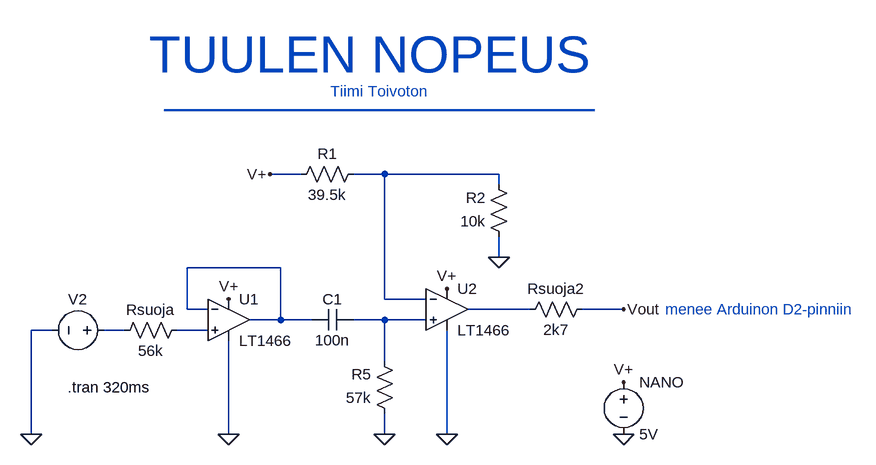
[diagram p0: schematic Tuulennopeus (Digitaalinen signaali).asc]
Tuulennopeus (Digitaalinen signaali).asc, the LTspice schematic file:
Version 4.1
SHEET 1 1392 680
WIRE 480 -64 432 -64
WIRE 608 -64 560 -64
WIRE 784 -64 608 -64
WIRE 784 -48 784 -64
WIRE 784 64 784 32
WIRE 448 80 304 80
WIRE 608 128 608 -64
WIRE 672 128 608 128
WIRE 304 144 304 80
WIRE 336 144 304 144
WIRE 832 144 736 144
WIRE 976 144 912 144
WIRE 448 160 448 80
WIRE 448 160 400 160
WIRE 496 160 448 160
WIRE 608 160 560 160
WIRE 672 160 608 160
WIRE 96 176 64 176
WIRE 208 176 176 176
WIRE 336 176 288 176
WIRE 608 224 608 160
WIRE 64 336 64 176
WIRE 368 336 368 192
WIRE 608 336 608 304
WIRE 704 336 704 176
FLAG 432 -64 V+
FLAG 704 112 V+
FLAG 784 64 0
FLAG 976 256 V+
FLAG 976 336 0
FLAG 704 336 0
FLAG 976 144 Vout
FLAG 368 128 V+
FLAG 368 336 0
FLAG 608 336 0
FLAG 64 336 0
SYMBOL voltage 192 176 R90
WINDOW 0 -32 56 VBottom 2
WINDOW 3 32 56 Invisible 2
WINDOW 123 0 0 Left 0
WINDOW 39 0 0 Left 0
SYMATTR InstName V2
SYMATTR Value PULSE(0 2V 0 0.01u 0.01u 40m 115m)
SYMBOL res 304 160 R90
WINDOW 0 0 56 VBottom 2
WINDOW 3 32 56 VTop 2
SYMATTR InstName Rsuoja
SYMATTR Value 56k
SYMBOL res 800 48 R180
WINDOW 0 36 76 Left 2
WINDOW 3 36 40 Left 2
SYMATTR InstName R2
SYMATTR Value 10k
SYMBOL res 464 -48 R270
WINDOW 0 32 56 VTop 2
WINDOW 3 0 56 VBottom 2
SYMATTR InstName R1
SYMATTR Value 39.5k
SYMBOL voltage 976 240 R0
WINDOW 123 0 0 Left 0
WINDOW 39 0 0 Left 0
SYMATTR InstName NANO
SYMATTR Value 5V
SYMBOL res 928 128 R90
WINDOW 0 0 56 VBottom 2
WINDOW 3 32 56 VTop 2
SYMATTR InstName Rsuoja2
SYMATTR Value 2k7
SYMBOL cap 560 144 R90
WINDOW 0 0 32 VBottom 2
WINDOW 3 32 32 VTop 2
SYMATTR InstName C1
SYMATTR Value 100n
SYMBOL res 624 320 R180
WINDOW 0 36 76 Left 2
WINDOW 3 36 40 Left 2
SYMATTR InstName R5
SYMATTR Value 57k
SYMBOL OpAmps\\LT1466 368 96 R0
SYMATTR InstName U1
SYMBOL OpAmps\\LT1466 704 80 R0
SYMATTR InstName U2
TEXT 120 264 Left 2 !.tran 320ms
TEXT 584 -248 Center 6 ;TUULEN NOPEUS
TEXT 1040 144 Left 2 ;menee Arduinon D2-pinniin
TEXT 600 -192 Center 2 ;Tiimi Toivoton
TEXT 600 -192 Center 5 ;_____________________

The netlist it stands for:
* Tuulennopeus (Digitaalinen signaali).asc
V2 N005 0 PULSE(0 2V 0 0.01u 0.01u 40m 115m)
Rsuoja N006 N005 56k
R2 0 N001 10k
R1 V+ N001 39.5k
V§NANO V+ 0 5V
Rsuoja2 Vout N003 2k7
C1 N004 N002 100n
R5 0 N004 57k
X§U1 N006 N002 V+ 0 N002 LT1466  ; pins In+ In- V+ V- OUT
X§U2 N004 N001 V+ 0 N003 LT1466  ; pins In+ In- V+ V- OUT
.tran 320ms
* TUULEN NOPEUS
* menee Arduinon D2-pinniin
* Tiimi Toivoton
* _____________________
.backanno
.end